# EAGLE design stim_headstage_32 (EAGLE 7.5.0)
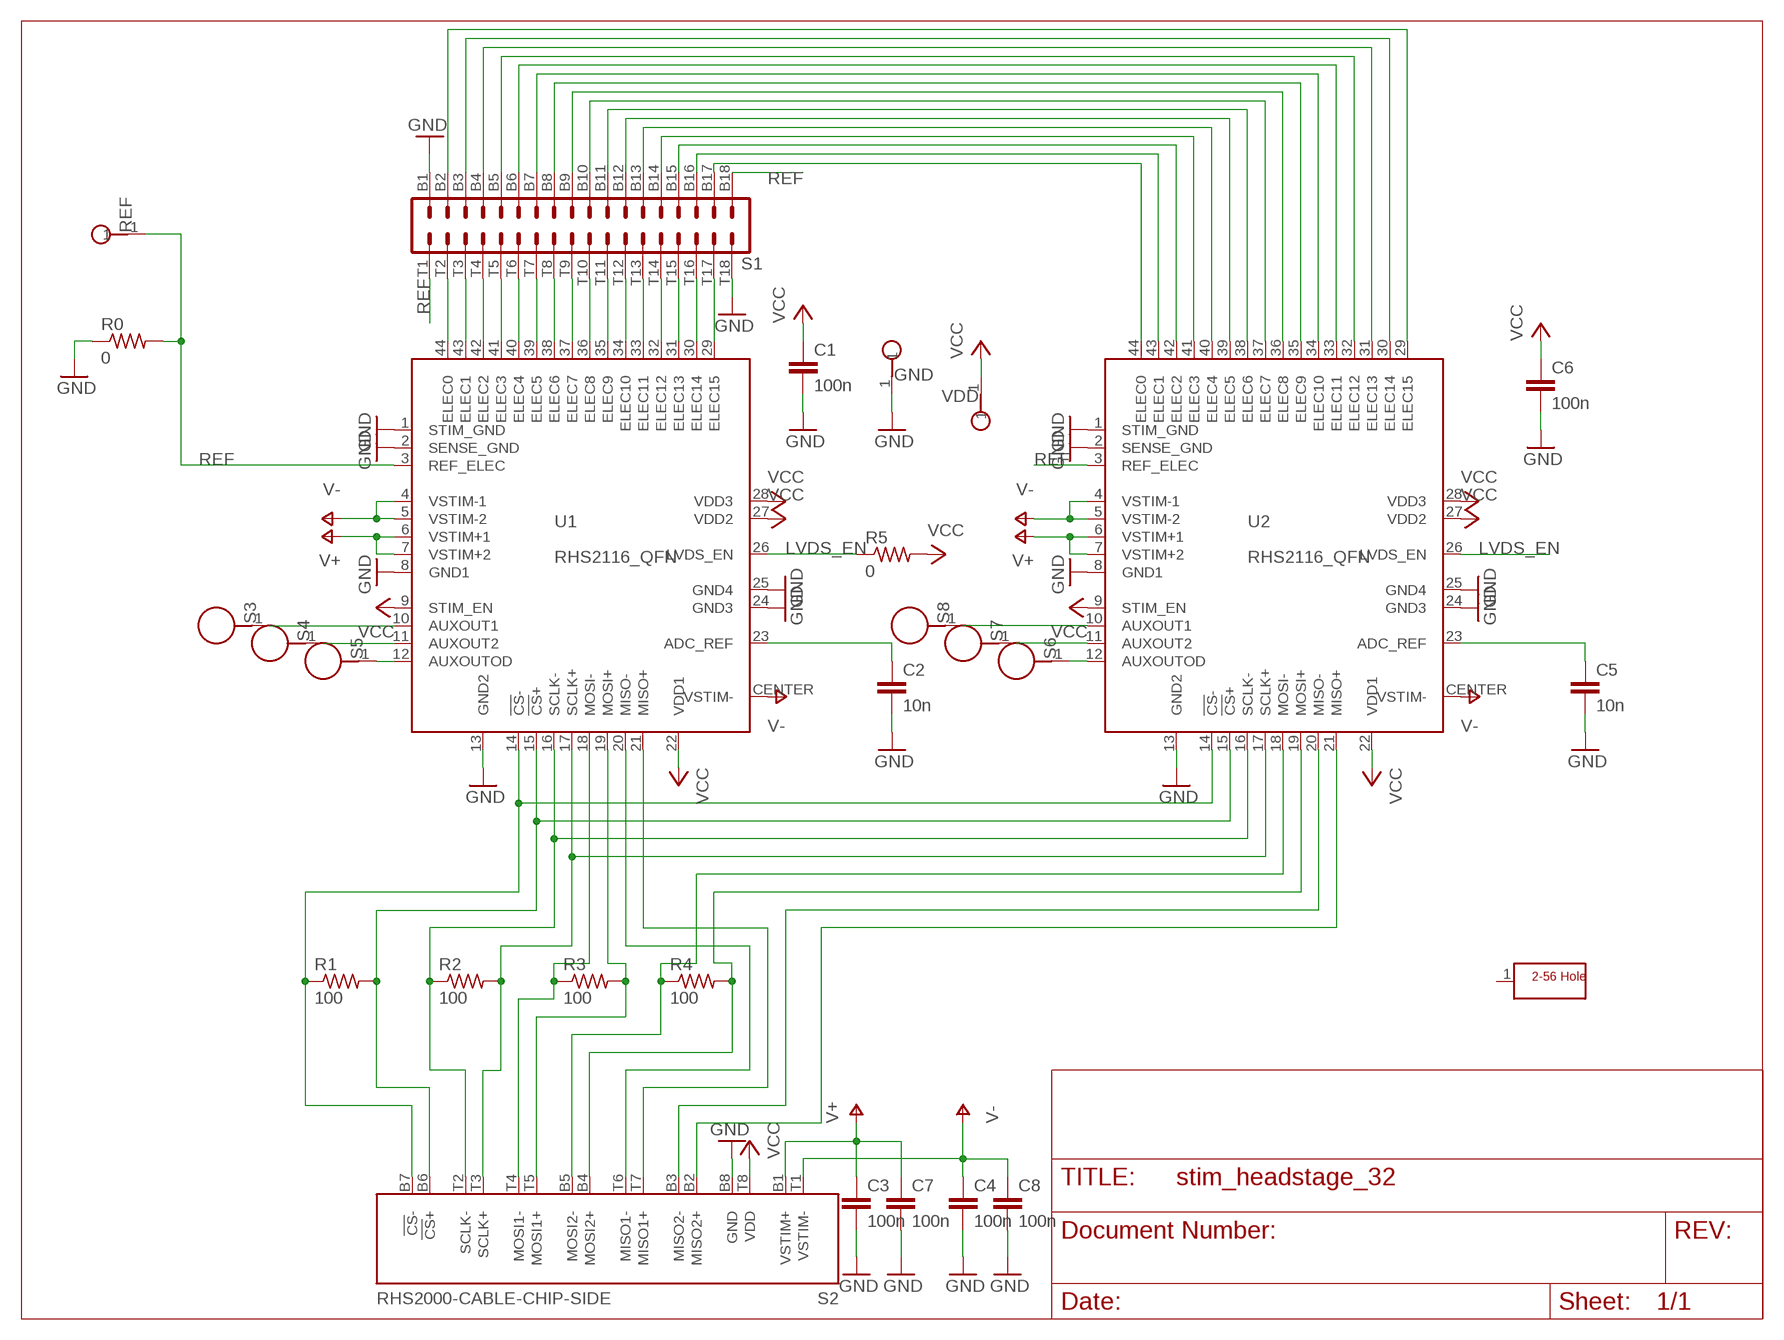
[diagram p0: schematic, sheet 1]

## Parts
C1  100n  C_0402  [0402]
C2  10n  C_0402  [0402]
C3  100n  C_0402  [0402]
C4  100n  C_0402  [0402]
C5  10n  C_0402  [0402]
C6  100n  C_0402  [0402]
C7  100n  C_0402  [0402]
C8  100n  C_0402  [0402]
GND  TESTPOINT_SMALL  [TESTPOINT_SMALL]
H1  SCREW_HOLE_2-56  [SCREW_HOLE_2-56]
R0  0  R_0402  [0402]
R1  100  R_0201  [0201]
R2  100  R_0201  [0201]
R3  100  R_0201  [0201]
R4  100  R_0201  [0201]
R5  0  R_0201  [0201]
REF  TESTPOINT_SMALL  [TESTPOINT_SMALL]
S1  OMNETICS_A79025  [OMNETICS_A79025]
S2  RHS2000-CABLE-CHIP-SIDE  [OMNETICS_PZN-16-AA]
S3  SMD_CONTACT_1_0_X_1_2  [SMD_PAD_1_0_X_1_2]
S4  SMD_CONTACT_1_0_X_1_2  [SMD_PAD_1_0_X_1_2]
S5  SMD_CONTACT_1_0_X_1_2  [SMD_PAD_1_0_X_1_2]
S6  SMD_CONTACT_1_0_X_1_2  [SMD_PAD_1_0_X_1_2]
S7  SMD_CONTACT_1_0_X_1_2  [SMD_PAD_1_0_X_1_2]
S8  SMD_CONTACT_1_0_X_1_2  [SMD_PAD_1_0_X_1_2]
U1  RHS2116_QFN  [QFN44_7_X_7]
U2  RHS2116_QFN  [QFN44_7_X_7]
VDD  TESTPOINT_SMALL  [TESTPOINT_SMALL]

## Nets
GND: C1.2 C2.2 C3.2 C4.2 C5.2 C6.2 C7.2 C8.2 GND.1 R0.1 S1.B1 S1.T18 S2.B8(GND) U1.1(STIM_GND) U1.2(SENSE_GND) U1.8(GND1) U1.13(GND2) U1.24(GND3) U1.25(GND4) U2.1(STIM_GND) U2.2(SENSE_GND) U2.8(GND1) U2.13(GND2) U2.24(GND3) U2.25(GND4)
LVDS_EN: R5.1 U1.26(LVDS_EN) U2.26(LVDS_EN)
N$1: S1.B16 U2.43(ELEC1)
N$2: S2.T6(MISO1-) U1.20(MISO-)
N$3: S1.B15 U2.42(ELEC2)
N$4: S2.T7(MISO1+) U1.21(MISO+)
N$5: S6.1 U2.12(AUXOUTOD)
N$6: S3.1 U1.10(AUXOUT1)
N$7: S4.1 U1.11(AUXOUT2)
N$8: S5.1 U1.12(AUXOUTOD)
N$9: C5.1 U2.23(ADC_REF)
N$10: S2.B2(MISO2+) U2.21(MISO+)
N$11: R1.1 S2.B7(!CS!-) U1.14(!CS!-) U2.14(!CS!-)
N$12: S2.B3(MISO2-) U2.20(MISO-)
N$13: S7.1 U2.11(AUXOUT2)
N$14: S8.1 U2.10(AUXOUT1)
N$15: S1.T2 U1.44(ELEC0)
N$16: S1.T3 U1.43(ELEC1)
N$17: S1.T4 U1.42(ELEC2)
N$18: S1.T5 U1.41(ELEC3)
N$19: S1.T6 U1.40(ELEC4)
N$20: S1.T7 U1.39(ELEC5)
N$21: S1.T8 U1.38(ELEC6)
N$22: S1.T9 U1.37(ELEC7)
N$23: S1.T10 U1.36(ELEC8)
N$24: S1.T11 U1.35(ELEC9)
N$25: S1.T12 U1.34(ELEC10)
N$26: S1.T13 U1.33(ELEC11)
N$27: S1.T14 U1.32(ELEC12)
N$28: S1.T15 U1.31(ELEC13)
N$29: S1.T16 U1.30(ELEC14)
N$30: S1.T17 U1.29(ELEC15)
N$31: S1.B17 U2.44(ELEC0)
N$32: S1.B14 U2.41(ELEC3)
N$33: S1.B13 U2.40(ELEC4)
N$34: S1.B12 U2.39(ELEC5)
N$35: R1.2 S2.B6(!CS!+) U1.15(!CS!+) U2.15(!CS!+)
N$36: R2.1 S2.T2(SCLK-) U1.16(SCLK-) U2.16(SCLK-)
N$37: R2.2 S2.T3(SCLK+) U1.17(SCLK+) U2.17(SCLK+)
N$38: R3.1 S2.T4(MOSI1-) U1.18(MOSI-)
N$39: R3.2 S2.T5(MOSI1+) U1.19(MOSI+)
N$40: R4.1 S2.B5(MOSI2-) U2.18(MOSI-)
N$41: R4.2 S2.B4(MOSI2+) U2.19(MOSI+)
N$42: C2.1 U1.23(ADC_REF)
N$43: S1.B11 U2.38(ELEC6)
N$44: S1.B10 U2.37(ELEC7)
N$45: S1.B9 U2.36(ELEC8)
N$46: S1.B8 U2.35(ELEC9)
N$47: S1.B7 U2.34(ELEC10)
N$48: S1.B6 U2.33(ELEC11)
N$49: S1.B5 U2.32(ELEC12)
N$50: S1.B4 U2.31(ELEC13)
N$51: S1.B3 U2.30(ELEC14)
N$52: S1.B2 U2.29(ELEC15)
REF: R0.2 REF.1 S1.B18 S1.T1 U1.3(REF_ELEC) U2.3(REF_ELEC)
V+: C3.1 C7.1 S2.B1(VSTIM+) U1.6(VSTIM+1) U1.7(VSTIM+2) U2.6(VSTIM+1) U2.7(VSTIM+2)
V-: C4.1 C8.1 S2.T1(VSTIM-) U1.4(VSTIM-1) U1.5(VSTIM-2) U1.CENTER(VSTIM-) U2.4(VSTIM-1) U2.5(VSTIM-2) U2.CENTER(VSTIM-)
VCC: C1.1 C6.1 R5.2 S2.T8(VDD) U1.9(STIM_EN) U1.22(VDD1) U1.27(VDD2) U1.28(VDD3) U2.9(STIM_EN) U2.22(VDD1) U2.27(VDD2) U2.28(VDD3) VDD.1
Unconnected: H1.1

## Library data of the parts
C1-C8 = RHD2000_eval_board:C: Capacitor
GND REF VDD = RHD2000_eval_board:TESTPOINT: PCB Test Point
H1 = RHD2000_eval_board:SCREW_HOLE_2-56: Mounting hole
R0 R1-R5 = RHD2000_eval_board:R: Resistor
S1 = RHS2000:OMNETICS_A79025: Omnetics A79025 36-pin connector
S2 = RHS2000:RHS2000-CABLE-CHIP-SIDE: Omnetics A79633 PZN-16-AA connector for RHS2000 interface (chip side)
S3-S8 = harrison:SMD_CONTACT
U1 U2 = RHS2000:RHS2116: Intan Technologies RHS2116 chip

## Net classes
1 thick: width 1.016 mm
2 power: width 0.61 mm

## Board
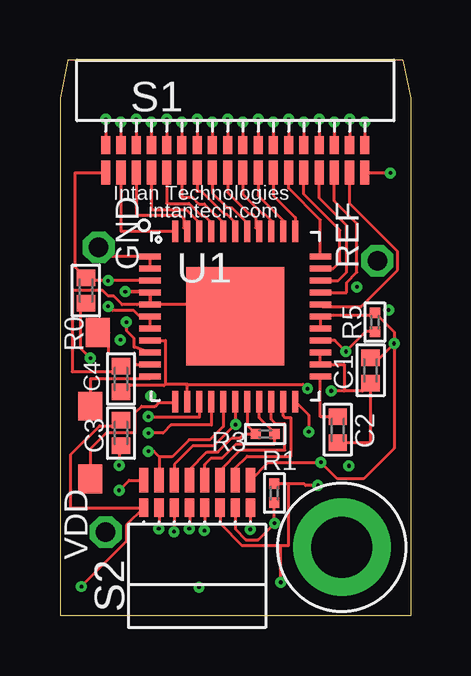
[diagram p1: board, top side]
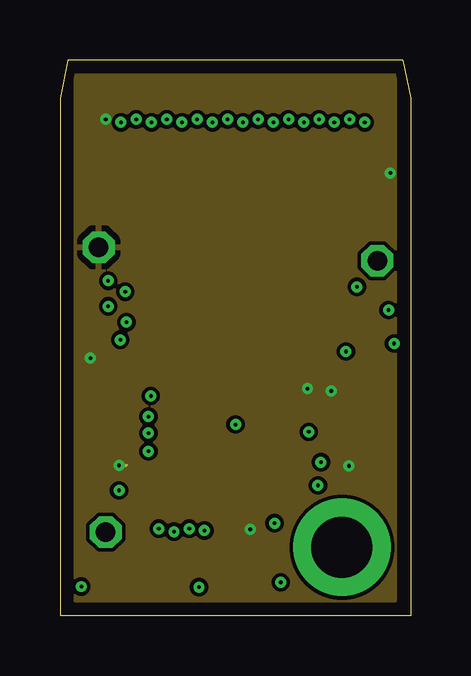
[diagram p2: board, inner layer Route2]
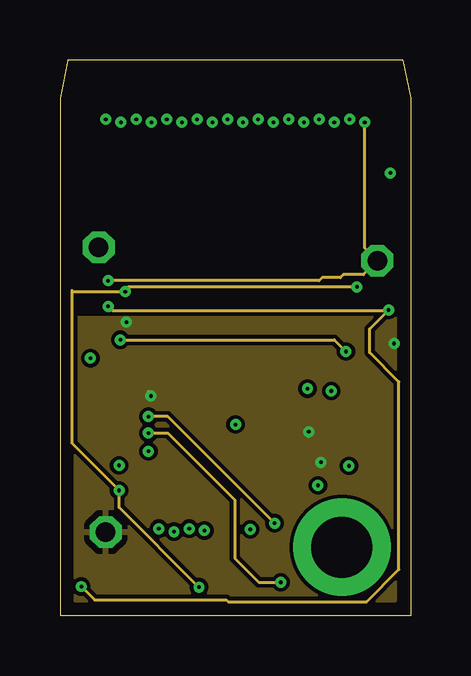
[diagram p3: board, inner layer Route3]
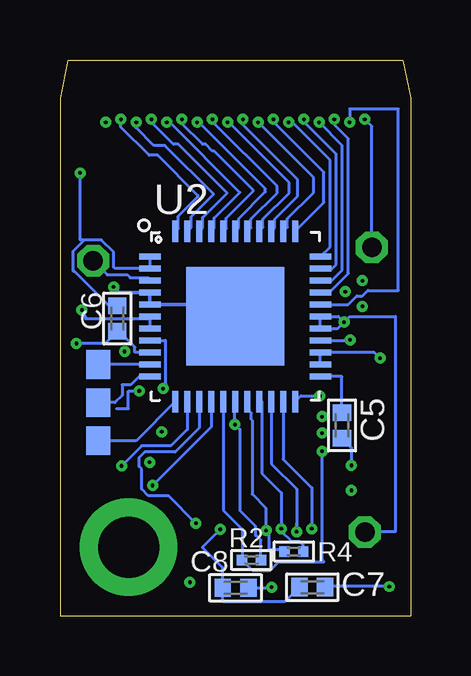
[diagram p4: board, bottom side, seen from below]

Size 14.61 x 23.18 mm. Coordinates in mm from the lower left corner, seen from the top.
Outline: 14.61,0 0,0 0,21.59 0.32,23.18 14.29,23.18 14.61,21.59 14.61,0
Copper layers (1*2+3*16): Top 0.035mm / dielectric 1.5mm / Route2 0.035mm / dielectric 0.15mm / Route3 0.035mm / dielectric 0.2mm / Bottom 0.035mm
Design rules "default *": minimum track width 5mil, minimum drill 6mil, track to track 6mil, track to pad 5mil, pad to pad 5mil, via to via 5mil, smd to smd 5mil, copper to edge 15mil, drill to drill 15mil, minimum pad ring 10mil, minimum via ring 6mil, stop-mask expansion 4mil, vias tented up to drill 0mil, thermal gap 10mil

### Footprints (pad centres in the part's own frame; a part is rotated, then mirrored left to right if it is on the bottom)
0402 = smd 0.686 x 0.762: 1 -0.533,0; 2 0.533,0
TESTPOINT_SMALL = drill 0.813 octagon: 1 0,0
SCREW_HOLE_2-56 = drill 2.54 pad 4.064: 1 0,0
0201 = smd 0.432 x 0.432: 1 -0.394,0; 2 0.394,0
OMNETICS_A79025 = smd 0.381 x 0.762: B1 -5.397,-1.016; B2 -4.763,-1.016; B3 -4.128,-1.016; B4 -3.493,-1.016; B5 -2.857,-1.016; B6 -2.223,-1.016; B7 -1.587,-1.016; B8 -0.953,-1.016; B9 -0.318,-1.016; B10 0.318,-1.016; B11 0.953,-1.016; B12 1.587,-1.016; B13 2.223,-1.016; B14 2.857,-1.016; B15 3.493,-1.016; B16 4.128,-1.016; B17 4.763,-1.016; B18 5.397,-1.016 | smd 0.381 x 1.016: T1 -5.397,-2.159; T2 -4.763,-2.159; T3 -4.128,-2.159; T4 -3.493,-2.159; T5 -2.857,-2.159; T6 -2.223,-2.159; T7 -1.587,-2.159; T8 -0.953,-2.159; T9 -0.318,-2.159; T10 0.318,-2.159; T11 0.953,-2.159; T12 1.587,-2.159; T13 2.223,-2.159; T14 2.857,-2.159; T15 3.493,-2.159; T16 4.128,-2.159; T17 4.763,-2.159; T18 5.397,-2.159
OMNETICS_PZN-16-AA = smd 0.381 x 0.762: B1 2.223,-1.016; B2 1.587,-1.016; B3 0.953,-1.016; B4 0.318,-1.016; B5 -0.318,-1.016; B6 -0.953,-1.016; B7 -1.587,-1.016; B8 -2.223,-1.016 | smd 0.381 x 1.016: T1 2.223,-2.159; T2 1.587,-2.159; T3 0.953,-2.159; T4 0.318,-2.159; T5 -0.318,-2.159; T6 -0.953,-2.159; T7 -1.587,-2.159; T8 -2.223,-2.159
SMD_PAD_1_0_X_1_2 = smd 1 x 1.2: 1 0,0
QFN44_7_X_7 = smd 0.9 x 0.25: 1 -3.55,2.5; 2 -3.55,2; 3 -3.55,1.5; 4 -3.55,1; 5 -3.55,0.5; 6 -3.55,0; 7 -3.55,-0.5; 8 -3.55,-1; 9 -3.55,-1.5; 10 -3.55,-2; 11 -3.55,-2.5; 23 3.55,-2.5; 24 3.55,-2; 25 3.55,-1.5; 26 3.55,-1; 27 3.55,-0.5; 28 3.55,0; 29 3.55,0.5; 30 3.55,1; 31 3.55,1.5; 32 3.55,2; 33 3.55,2.5 | smd 0.25 x 0.9: 12 -2.5,-3.55; 13 -2,-3.55; 14 -1.5,-3.55; 15 -1,-3.55; 16 -0.5,-3.55; 17 0,-3.55; 18 0.5,-3.55; 19 1,-3.55; 20 1.5,-3.55; 21 2,-3.55; 22 2.5,-3.55; 34 2.5,3.55; 35 2,3.55; 36 1.5,3.55; 37 1,3.55; 38 0.5,3.55; 39 0,3.55; 40 -0.5,3.55; 41 -1,3.55; 42 -1.5,3.55; 43 -2,3.55; 44 -2.5,3.55 | smd 4.1 x 4.1: CENTER 0,0

### Placement (x,y rotation side)
C1  12.94,10.24 270 top
C2  11.57,7.76 270 top
C3  2.54,7.62 270 top
C4  2.54,9.88 270 top
C5  2.86,7.94 270 bottom
C6  12.22,12.4 90 bottom
C7  4.09,1.19 180 bottom
C8  7.29,1.17 180 bottom
GND  1.61,15.37 90 top
H1  11.75,2.86 0 top
R0  1.08,13.56 90 top
R1  8.93,5.12 90 top
R2  6.63,2.32 0 bottom
R3  8.55,7.58 0 top
R4  4.86,2.68 0 bottom
R5  13.12,12.24 90 top
REF  13.22,14.81 270 top
S1  7.3,20.64 0 top
S2  5.71,3.49 180 top
S3  1.57,11.81 180 top
S4  1.27,8.74 0 top
S5  1.27,5.71 0 top
S6  13.02,7.3 0 bottom
S7  13.02,8.89 0 bottom
S8  13.02,10.48 0 bottom
U1  7.3,12.48 0 top
U2  7.3,12.48 0 bottom
VDD  1.91,3.49 0 top

### Tracks (layer width: path | path; a pad name or v marks a point on that pad's centre or on a via)
GND  (via drill 0.15)
  Top 0.127: C3.2 2.46,6.81 v2.46,6.27 | U1.25 U1.24 11.84,10.48 11.84,9.37 | S2.B8 7.92,4.5 v7.92,3.61 | U1.13 5.3,9.65 | 5.3,9.65 4.39,9.65 | GND.1 2,14.98 U1.1 U1.2 | R0.1 1.03,12.8 0.89,12.8 0.84,12.75 0.84,11.18 v1.27,10.74 | 11.84,9.37 12.61,9.37 C1.2 12.94,7.23 C2.2 | 11.84,9.37 v11.3,9.37 | U1.8 4.39,11.48 4.39,9.65 | 5.3,9.65 10.13,9.65 v10.31,9.47 | v13.77,18.47 12.7,18.47 S1.T18 | C4.2 2.54,9.6 4.34,9.6 4.39,9.65 | v1.91,20.7 S1.B1
  Route2 0.127: v2.46,6.27 2.77,6.27 | v11.3,9.37 11.46,9.37 | v12.04,6.25 12.17,6.25 12.19,6.22 | v10.31,9.47 10.44,9.47 | v1.27,10.74 1.4,10.74
  Bottom 0.127: 7.82,0.84 C8.2 | C5.2 2.46,7.01 v2.46,6.27 | v7.92,3.61 8.67,2.86 7.82,2.01 C8.2 | C7.2 5.23,0.58 7.82,0.58 C8.2 | 12.24,8.64 11.76,8.64 11.76,9.37 v11.3,9.37 | U2.13 9.3,7.77 9.98,7.09 11.2,7.09 v12.04,6.25 | U2.24 U2.25 3.74,11 1.52,11 v1.27,10.74 | 13.59,15.67 12.88,15.67 12.37,15.16 12.37,14.54 12.31,14.48 U2.2 U2.1 | 13.59,15.67 14.07,15.19 14.07,14.43 arc-90 14.02,14.38 12.57,12.93 C6.2 | U2.8 10.21,11.48 10.21,9.58 v10.31,9.47 | 13.59,15.67 13.77,15.67 v13.77,18.47 | GND.1 1.61,20.41 v1.91,20.7
  pour Route2: 0.64,0.64 13.97,0.64 13.97,22.54 0.64,22.54
LVDS_EN  (via drill 0.15)
  Top 0.127: U1.26 11.45,11.48 v11.91,11.02 12.74,11.85 R5.1
  Route3 0.127: v2.52,11.51 11.43,11.51 v11.91,11.02
  Bottom 0.127: U2.26 2.54,11.48 v2.52,11.51
N$1  (via drill 0.15)
  Top 0.127: v11.43,20.57 S1.B16
  Bottom 0.127: U2.43 9.14,16.19 9.14,16.64 8.2,17.58 10.24,19.61 10.69,19.61 11.43,20.34 v11.43,20.57
N$2
  Top 0.127: S2.T6 6.67,6.06 7.52,6.91 9.37,6.91 9.37,8 8.99,8 8.8,8.19 U1.20
N$3  (via drill 0.15)
  Top 0.127: v10.79,20.7 S1.B15
  Bottom 0.127: U2.42 8.66,16.18 8.66,16.61 7.64,17.63 9.68,19.66 9.88,19.66 10.79,20.57 v10.79,20.7
N$4
  Top 0.127: S2.T7 7.3,6.16 7.8,6.66 9.63,6.66 9.63,8.26 9.37,8.26 9.3,8.32 U1.21
N$5
  Bottom 0.127: U2.12 11.43,7.3 S6.1
N$6
  Top 0.127: 3.68,10.41 arc90 U1.10 3.12,10.48 3.12,10.77 3.07,10.95 2.03,10.95 2.03,11.81 S3.1
N$7
  Top 0.127: S4.1 1.27,9.88 3.75,9.88 U1.11
N$8
  Top 0.127: S5.1 1.27,6.96 1.93,7.62 3.12,7.62 3.12,8.46 3.4,8.74 3.96,8.74 4.12,8.89 4.76,8.89 U1.12
N$9
  Bottom 0.127: C5.1 2.86,9.98 U2.23
N$10  (via drill 0.15)
  Top 0.127: S2.B2 4.13,3.65 v4.12,3.63
  Bottom 0.127: U2.21 5.31,6.53 4.12,5.33 v4.12,3.63
N$11  (via drill 0.15)
  Top 0.127: S2.B7 7.3,3.62 7.75,3.17 8.26,3.17 v8.94,3.86 8.93,3.86 R1.1 | U1.14 5.8,8.28 3.71,8.28 arc-90 v3.68,8.31
  Route3 0.127: v8.94,3.86 4.5,8.31 v3.68,8.31
  Bottom 0.127: U2.14 8.8,7.83 9.8,6.83 11.07,6.83 11.3,6.6 11.3,6.22 11.2,6.12 11.2,5.28 10.92,5 10.08,5 v8.94,3.86
N$12  (via drill 0.15)
  Top 0.127: S2.B3 4.76,3.5 v4.75,3.5
  Bottom 0.127: 4.75,3.86 v4.75,3.5 4.75,5.28 5.8,6.34 U2.20
N$13
  Bottom 0.127: U2.11 11.3,9.98 11.66,9.63 12.01,9.63 12.01,9.2 12.32,8.89 S7.1 12.7,8.89
N$14
  Bottom 0.127: U2.10 S8.1
N$15
  Top 0.127: S1.T2 2.54,16.03 U1.44
N$16
  Top 0.127: S1.T3 3.17,16.69 5.03,16.69 5.16,16.56 5.16,16.18 U1.43
N$17
  Top 0.127: S1.T4 3.81,16.94 5.26,16.94 5.8,16.4 U1.42 | 5.8,16.35 U1.42 | 5.8,16.37 U1.42
N$18
  Top 0.127: S1.T5 4.45,17.2 5.38,17.2 5.89,16.69 6.02,16.69 6.3,16.41 U1.41 6.3,16.38
N$19
  Top 0.127: S1.T6 5.08,17.45 5.51,17.45 5.79,17.17 6.02,17.17 6.8,16.39 U1.40
N$20
  Top 0.127: S1.T7 5.71,17.7 5.89,17.7 6.86,16.74 6.96,16.74 7.3,16.4 U1.39 7.3,16.29
N$21
  Top 0.127: S1.T8 6.35,17.63 6.96,17.02 7.16,17.02 7.8,16.38 U1.38
N$22
  Top 0.127: S1.T9 6.99,17.65 7.87,16.76 8,16.76 8.15,16.61 8.15,16.18 U1.37
N$23
  Top 0.127: S1.T10 7.62,17.58 8.43,16.76 8.51,16.76 8.8,16.47 U1.36
N$24
  Top 0.127: S1.T11 8.26,17.53 9.3,16.48 U1.35
N$25
  Top 0.127: S1.T12 8.89,17.53 9.8,16.61 U1.34
N$26
  Top 0.127: U1.33 10.85,16.5 9.53,17.83 S1.T13
N$27
  Top 0.127: U1.32 11.38,14.48 11.66,14.76 11.66,16.08 10.16,17.58 S1.T14
N$28
  Top 0.127: U1.31 11.6,13.98 11.94,14.33 11.94,16.28 10.79,17.42 S1.T15
N$29
  Top 0.127: U1.30 11.94,13.48 11.94,13.89 12.37,14.33 12.37,16.36 11.43,17.3 S1.T16
N$30
  Top 0.127: U1.29 10.93,12.9 12.55,12.9 14.07,14.43 14.07,15.19 12.06,17.2 S1.T17
N$31  (via drill 0.15)
  Top 0.127: v12.06,20.7 S1.B17
  Bottom 0.127: U2.44 9.68,16.16 9.68,16.66 8.87,17.48 8.87,17.53 10.54,19.2 10.9,19.2 12.06,20.37 v12.06,20.7
N$32  (via drill 0.15)
  Top 0.127: v10.16,20.57 S1.B14
  Bottom 0.127: U2.41 8.18,16.16 8.18,16.59 7.11,17.65 10.03,20.57 v10.16,20.57
N$33  (via drill 0.15)
  Top 0.127: v9.53,20.7 S1.B13
  Bottom 0.127: U2.40 7.67,16.17 7.67,16.59 6.55,17.7 6.55,17.75 8.18,19.38 8.26,19.38 8.53,19.66 8.66,19.66 9.53,20.52 v9.53,20.7
N$34  (via drill 0.15)
  Top 0.127: v8.89,20.57 S1.B12
  Bottom 0.127: U2.39 7.16,16.17 7.16,16.56 6.04,17.68 6.04,17.8 8.81,20.57 v8.89,20.57
N$35  (via drill 0.15)
  Top 0.127: S2.B6 6.67,3.85 7.59,2.92 8.94,2.92 9.2,2.92 | 9.2,2.92 9.53,2.92 9.53,5.51 | v10.74,5.44 10.24,5.44 10.16,5.51 9.53,5.51 | R1.2 9.53,5.51 | U1.15 6.3,7.95 4.62,7.95 4.29,7.62 v3.68,7.62 | v9.2,1.4 9.2,2.92
  Route3 0.127: v3.68,7.62 4.5,7.62 7.29,4.83 7.29,2.39 8.28,1.4 v9.2,1.4
  Bottom 0.127: U2.15 8.3,7.88 v10.74,5.44
N$36  (via drill 0.15)
  Top 0.127: U1.16 6.8,7.89 6.25,7.34 5.38,7.34 4.67,6.63 4.14,6.63 | S2.T2 4.13,6.63 4.14,6.63 | 4.14,6.63 3.91,6.86 v3.68,6.86
  Bottom 0.127: 7.02,3.59 7.01,3.61 | 7.01,3.61 7.01,2.34 R2.1 6.6,1.91 5.84,1.91 5.49,2.26 3.61,2.26 3.68,2.34 v3.68,6.86 | U2.16 7.8,4.4 7.01,3.61
N$37  (via drill 0.15)
  Top 0.127: U2.17 7.3,7.98 | 7.3,7.98 v7.32,7.98 | 7.3,7.98 6.41,7.09 5.54,7.09 4.76,6.31 S2.T3
  Bottom 0.127: U2.17 7.32,8.93 v7.32,7.98 7.11,7.77 7.11,4.39 6.45,3.73 6.45,3.35 6.43,3.35 6.24,3.16 R2.2
N$38
  Top 0.127: 5.4,5.92 S2.T4 5.4,6.11 6.12,6.83 6.58,6.83 7.16,7.42 7.49,7.42 7.66,7.58 R3.1 7.8,7.93 U1.18
N$39
  Top 0.127: U1.19 8.3,8.26 8.94,7.62 R3.2 8.94,7.16 7.34,7.16 6.76,6.58 6.3,6.58 6.03,6.31 S2.T5
N$40  (via drill 0.15)
  Top 0.127: S2.B5 6.03,3.56 v6.02,3.56
  Bottom 0.127: v6.02,3.56 5.99,3.56 5.99,3.68 | U2.18 6.8,8.63 6.63,8.46 6.63,8.18 6.6,8.15 6.6,5.08 S2.B5 6.03,3.57 v6.02,3.56 | R4.1 5.32,2.74 5.89,2.74 5.89,3.43 v6.02,3.56
N$41  (via drill 0.15)
  Top 0.127: S2.B4 5.4,3.65 v5.38,3.63
  Bottom 0.127: v5.38,3.63 5.38,3.76 | U2.19 6.2,8.93 6.2,5.94 5.38,5.13 v5.38,3.63 | R4.2 4.47,2.95 4.6,3.07 4.93,3.07 5.38,3.53 v5.38,3.63
N$42
  Top 0.127: C2.1 10.85,8.29 U1.23
N$43  (via drill 0.15)
  Top 0.127: v8.26,20.7 S1.B11
  Bottom 0.127: U2.38 6.66,16.18 6.66,16.54 5.56,17.63 5.56,17.91 8.26,20.6 v8.26,20.7
N$44  (via drill 0.15)
  Top 0.127: v7.62,20.57 S1.B10
  Bottom 0.127: U2.37 6.15,16.19 6.15,16.54 5.05,17.63 5.05,18.06 7.57,20.57 v7.62,20.57
N$45  (via drill 0.15)
  Top 0.127: v6.99,20.7 S1.B9
  Bottom 0.127: U2.36 5.66,16.17 5.66,16.54 4.7,17.5 4.7,18.19 6.99,20.47 v6.99,20.7
N$46  (via drill 0.15)
  Top 0.127: v6.35,20.57 S1.B8
  Bottom 0.127: U2.35 5.13,16.21 5.13,16.56 4.04,17.65 4.04,18.26 v6.35,20.57
N$47  (via drill 0.15)
  Top 0.127: v5.71,20.7 S1.B7
  Bottom 0.127: U2.34 3.61,17.23 3.61,18.49 5.71,20.6 v5.71,20.7
N$48  (via drill 0.15)
  Top 0.127: v5.08,20.57 S1.B6
  Bottom 0.127: U2.33 3.35,15.38 3.35,19 4.93,20.57 v5.08,20.57
N$49  (via drill 0.15)
  Top 0.127: v4.45,20.7 S1.B5
  Bottom 0.127: v4.45,20.7 4.45,20.6 3.1,19.25 3.1,14.66 3.27,14.48 U2.32
N$50  (via drill 0.15)
  Top 0.127: v3.81,20.57 S1.B4
  Bottom 0.127: U2.31 3.29,13.98 2.85,14.43 2.85,19.61 v3.81,20.57
N$51  (via drill 0.15)
  Top 0.127: v3.17,20.7 S1.B3
  Bottom 0.127: U2.30 3.38,13.48 2.59,14.28 2.59,19.89 3.17,20.47 v3.17,20.7
N$52  (via drill 0.15)
  Top 0.127: v2.54,20.57 S1.B2
  Bottom 0.127: U2.29 2.59,12.98 2.23,13.34 2.01,13.34 1.78,13.56 0.51,13.56 0.51,21.13 2.54,21.13 v2.54,20.57
REF  (via drill 0.15)
  Top 0.127: U1.3 2.52,13.98 v2.01,13.97 1.21,13.97 R0.2 | 1.19,13.98 R0.2 | R0.2 0.64,14.54 0.64,18.48 S1.T1 | v12.7,20.57 S1.B18
  Route3 0.127: v2.01,13.97 10.79,13.97 10.92,14.1 11.68,14.1 11.81,14.22 12.64,14.22 REF.1 12.7,15.33 v12.7,20.57
  Bottom 0.127: REF.1 12.64,14.22 11.81,14.22 11.68,14.1 10.96,14.1 arc90 U2.3
V+  (via drill 0.15)
  Top 0.127: C3.1 arc-90 2.52,7.92 1.65,7.92 0.46,6.73 0.46,4.51 S2.B1 2.77,3.79 2.77,3.1 v0.89,1.22 | U1.7 U1.6 | U1.6 | U1.6 3.31,12.48 3.07,12.72 2.18,12.72 v2.01,12.9
  Route3 0.127: v0.89,1.22 1.45,0.66 6.93,0.66 7.01,0.58 12.78,0.58 14.12,1.93 14.12,9.75 12.9,10.97 12.9,11.96 v13.69,12.75 13.69,12.72 2.18,12.72 v2.01,12.9
  Bottom 0.127: v0.89,1.22 3.53,1.22 C7.1 | v13.69,12.75 13.54,12.39 10.85,12.39 U2.6 U2.7
V-  (via drill 0.15)
  Top 0.127: U1.5 3.21,12.98 3.2,12.98 2.59,12.98 2.23,13.34 2.01,13.34 1.78,13.56 0.51,13.56 0.51,10.19 2.54,10.19 C4.1 | U1.5 U1.4 | U1.5 3.75,13.51 v2.72,13.51 3.76,13.51 U1.5 6.81,12.98 U2.CENTER | S2.T1 2.88,5.65 v2.46,5.23
  Route3 0.127: v12.37,13.72 2.85,13.72 v2.72,13.51 0.56,13.51 0.51,13.56 0.51,7.19 v2.46,5.23 2.46,4.52 v5.79,1.19
  Bottom 0.127: 12.12,13.49 12.11,13.48 U2.4 U2.5 7.3,12.98 U2.CENTER 7.8,12.98 10.87,12.98 10.87,13.49 12.12,13.49 | 12.12,13.49 v12.37,13.72 | C8.1 5.79,1.17 v5.79,1.19
VCC  (via drill 0.15)
  Top 0.127: U1.22 10.36,8.37 v10.36,7.67 | S2.T8 8.69,6.4 v10.87,6.4 11.56,5.71 12.65,5.71 13.92,6.99 v13.92,11.35 | v13.92,11.35 13.34,10.77 C1.1 | U1.27 U1.28 10.92,12.55 13.12,12.55 R5.2 13.92,11.84 v13.92,11.35 | v2.77,12.24 2.77,11.89 3.07,11.58 3.07,11.2 3.15,11.2 U1.9 3.37,10.98
  Route3 0.127: v10.36,7.67 10.36,7.47 | v3.79,9.17 3.66,9.35
  Bottom 0.127: U2.22 4.57,9.17 v3.79,9.17 | 0.64,12.48 0.64,12.47 | 0.64,12.47 0.64,3.5 1.91,3.5 VDD.1 | v13.92,11.35 12.72,11.35 C6.1 12.14,11.86 11.48,11.2 11.48,10.98 U2.9 | v2.77,12.24 3.03,11.98 U2.27 U2.28 3.01,12.48 v2.77,12.24 | v2.77,12.24 2.54,12.47 0.64,12.47
  pour Route3: 0.64,0.64 13.97,0.64 13.97,12.45 0.64,12.45

### Text on the board
tPlace: Intan Technologies | intantech.com